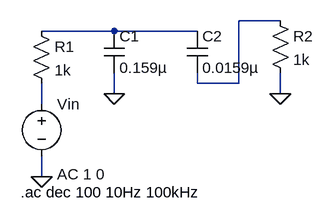
[diagram p0: schematic BANDPASS.asc]
BANDPASS.asc, the LTspice schematic file:
Version 4.1
SHEET 1 880 680
WIRE 400 128 336 128
WIRE 144 144 32 144
WIRE 272 144 144 144
WIRE 272 224 272 208
WIRE 336 224 336 128
WIRE 336 224 272 224
WIRE 144 240 144 208
WIRE 400 240 400 208
WIRE 32 256 32 224
WIRE 32 368 32 336
FLAG 400 240 0
FLAG 144 240 0
FLAG 32 368 0
SYMBOL res 16 128 R0
SYMATTR InstName R1
SYMATTR Value 1k
SYMBOL cap 128 144 R0
SYMATTR InstName C1
SYMATTR Value 0.159µ
SYMBOL cap 256 144 R0
SYMATTR InstName C2
SYMATTR Value 0.0159µ
SYMBOL res 384 112 R0
SYMATTR InstName R2
SYMATTR Value 1k
SYMBOL voltage 32 240 R0
WINDOW 123 24 124 Left 2
WINDOW 39 0 0 Left 0
SYMATTR InstName Vin
SYMATTR Value ""
SYMATTR Value2 AC 1 0
TEXT 0 392 Left 2 !.ac dec 100 10Hz 100kHz

The netlist it stands for:
* BANDPASS.asc
R1 N002 N003 1k
C1 N002 0 0.159µ
C2 N002 N001 0.0159µ
R2 N001 0 1k
Vin N003 0 AC 1 0
.ac dec 100 10Hz 100kHz
.backanno
.end